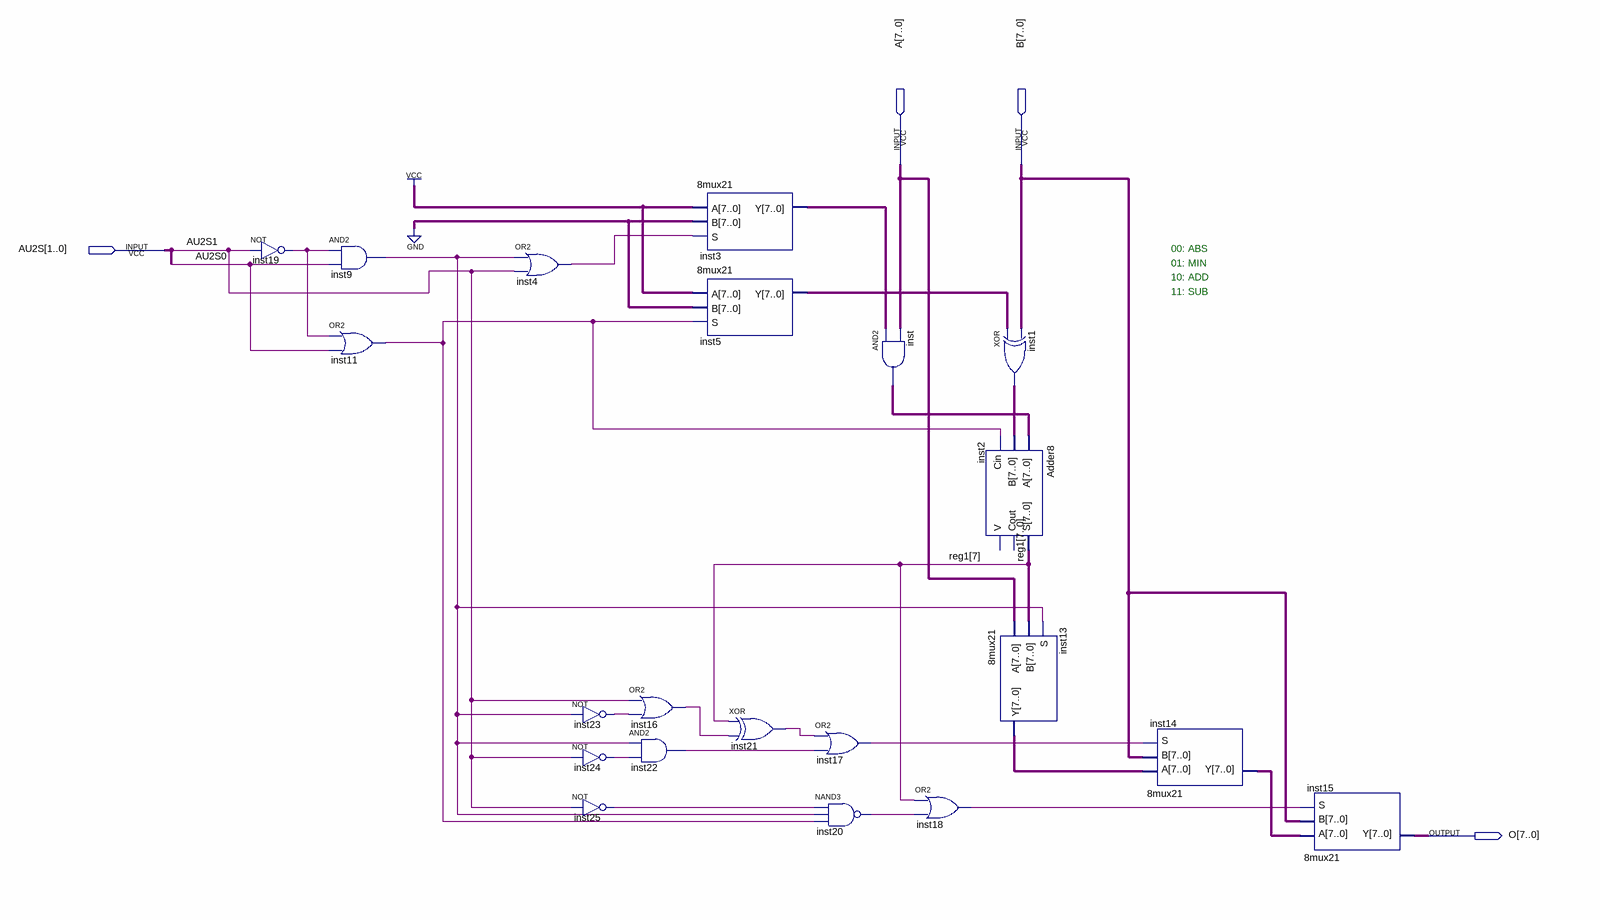
[diagram p0: schematic sheet]
// Quartus schematic AU2.bdf as structural Verilog: 21 symbols, 4 pins
module AU2 (
  input  [7:0] A,
  input  [7:0] B,
  input  [1:0] AU2S,
  output [7:0] O
);

  wire inst4_out, inst9_out, inst11_out, inst16_out, inst17_out, inst18_out, inst19_out, inst20_out,
       inst21_out, inst22_out, inst23_out, inst24_out, inst25_out;
  wire [7:0] inst1_out, inst3_y, inst5_y, inst13_y, inst14_y, inst_out, reg1;

  not inst19 (inst19_out, AU2S[1]);
  and inst9 (inst9_out, inst19_out, AU2S[0]);
  or inst11 (inst11_out, inst19_out, AU2S[0]);
  or inst4 (inst4_out, inst9_out, AU2S[1]);
  not inst23 (inst23_out, inst9_out);
  not inst24 (inst24_out, AU2S[1]);
  not inst25 (inst25_out, AU2S[1]);
  or inst16 (inst16_out, AU2S[1], inst23_out);
  and inst22 (inst22_out, inst9_out, inst24_out);
  \8mux21  inst3 (.A({8{1'b1}}), .B({8{1'b0}}), .S(inst4_out), .Y(inst3_y));
  \8mux21  inst5 (.A({8{1'b1}}), .B({8{1'b0}}), .S(inst11_out), .Y(inst5_y));
  xor inst21 (inst21_out, reg1[7], inst16_out);
  or inst17 (inst17_out, inst21_out, inst22_out);
  nand inst20 (inst20_out, inst25_out, inst9_out, inst11_out);
  assign inst_out = inst3_y & A;  // AND2 inst, 8 bits wide
  or inst18 (inst18_out, reg1[7], inst20_out);
  assign inst1_out = inst5_y ^ B;  // XOR inst1, 8 bits wide
  Adder8 inst2 (.A(inst_out), .B(inst1_out), .Cin(inst11_out), .S(reg1));  // open: Cout, V
  \8mux21  inst13 (.A(A), .B(reg1), .S(inst9_out), .Y(inst13_y));
  \8mux21  inst14 (.A(inst13_y), .B(B), .S(inst17_out), .Y(inst14_y));
  \8mux21  inst15 (.A(inst14_y), .B(B), .S(inst18_out), .Y(O));

  // Notes on the sheet:
  //   00: ABS
  //   01: MIN
  //   10: ADD
  //   11: SUB
endmodule
